# Altium schematic sheet DevCard.SchDoc: DevCard
size A3; Date: *******; ApprovedBy: *******; CheckedBy: None; Author: Annoyedmilk; CompanyName: *******; DrawnBy: Name; Engineer: *******; Organization: *******; Address1: *******; Address2: *******; Address3: *******; Address4: *******; DocumentNumber: Doc Num; Revision: *******; SheetNumber: 1; SheetTotal: 1; CurrentTime: *******; CurrentDate: *******; Time: *******; DocumentFullPathAndName: *******; DocumentName: *******; ModifiedDate: *******; ProjectName: *******; Application_BuildNumber: *******
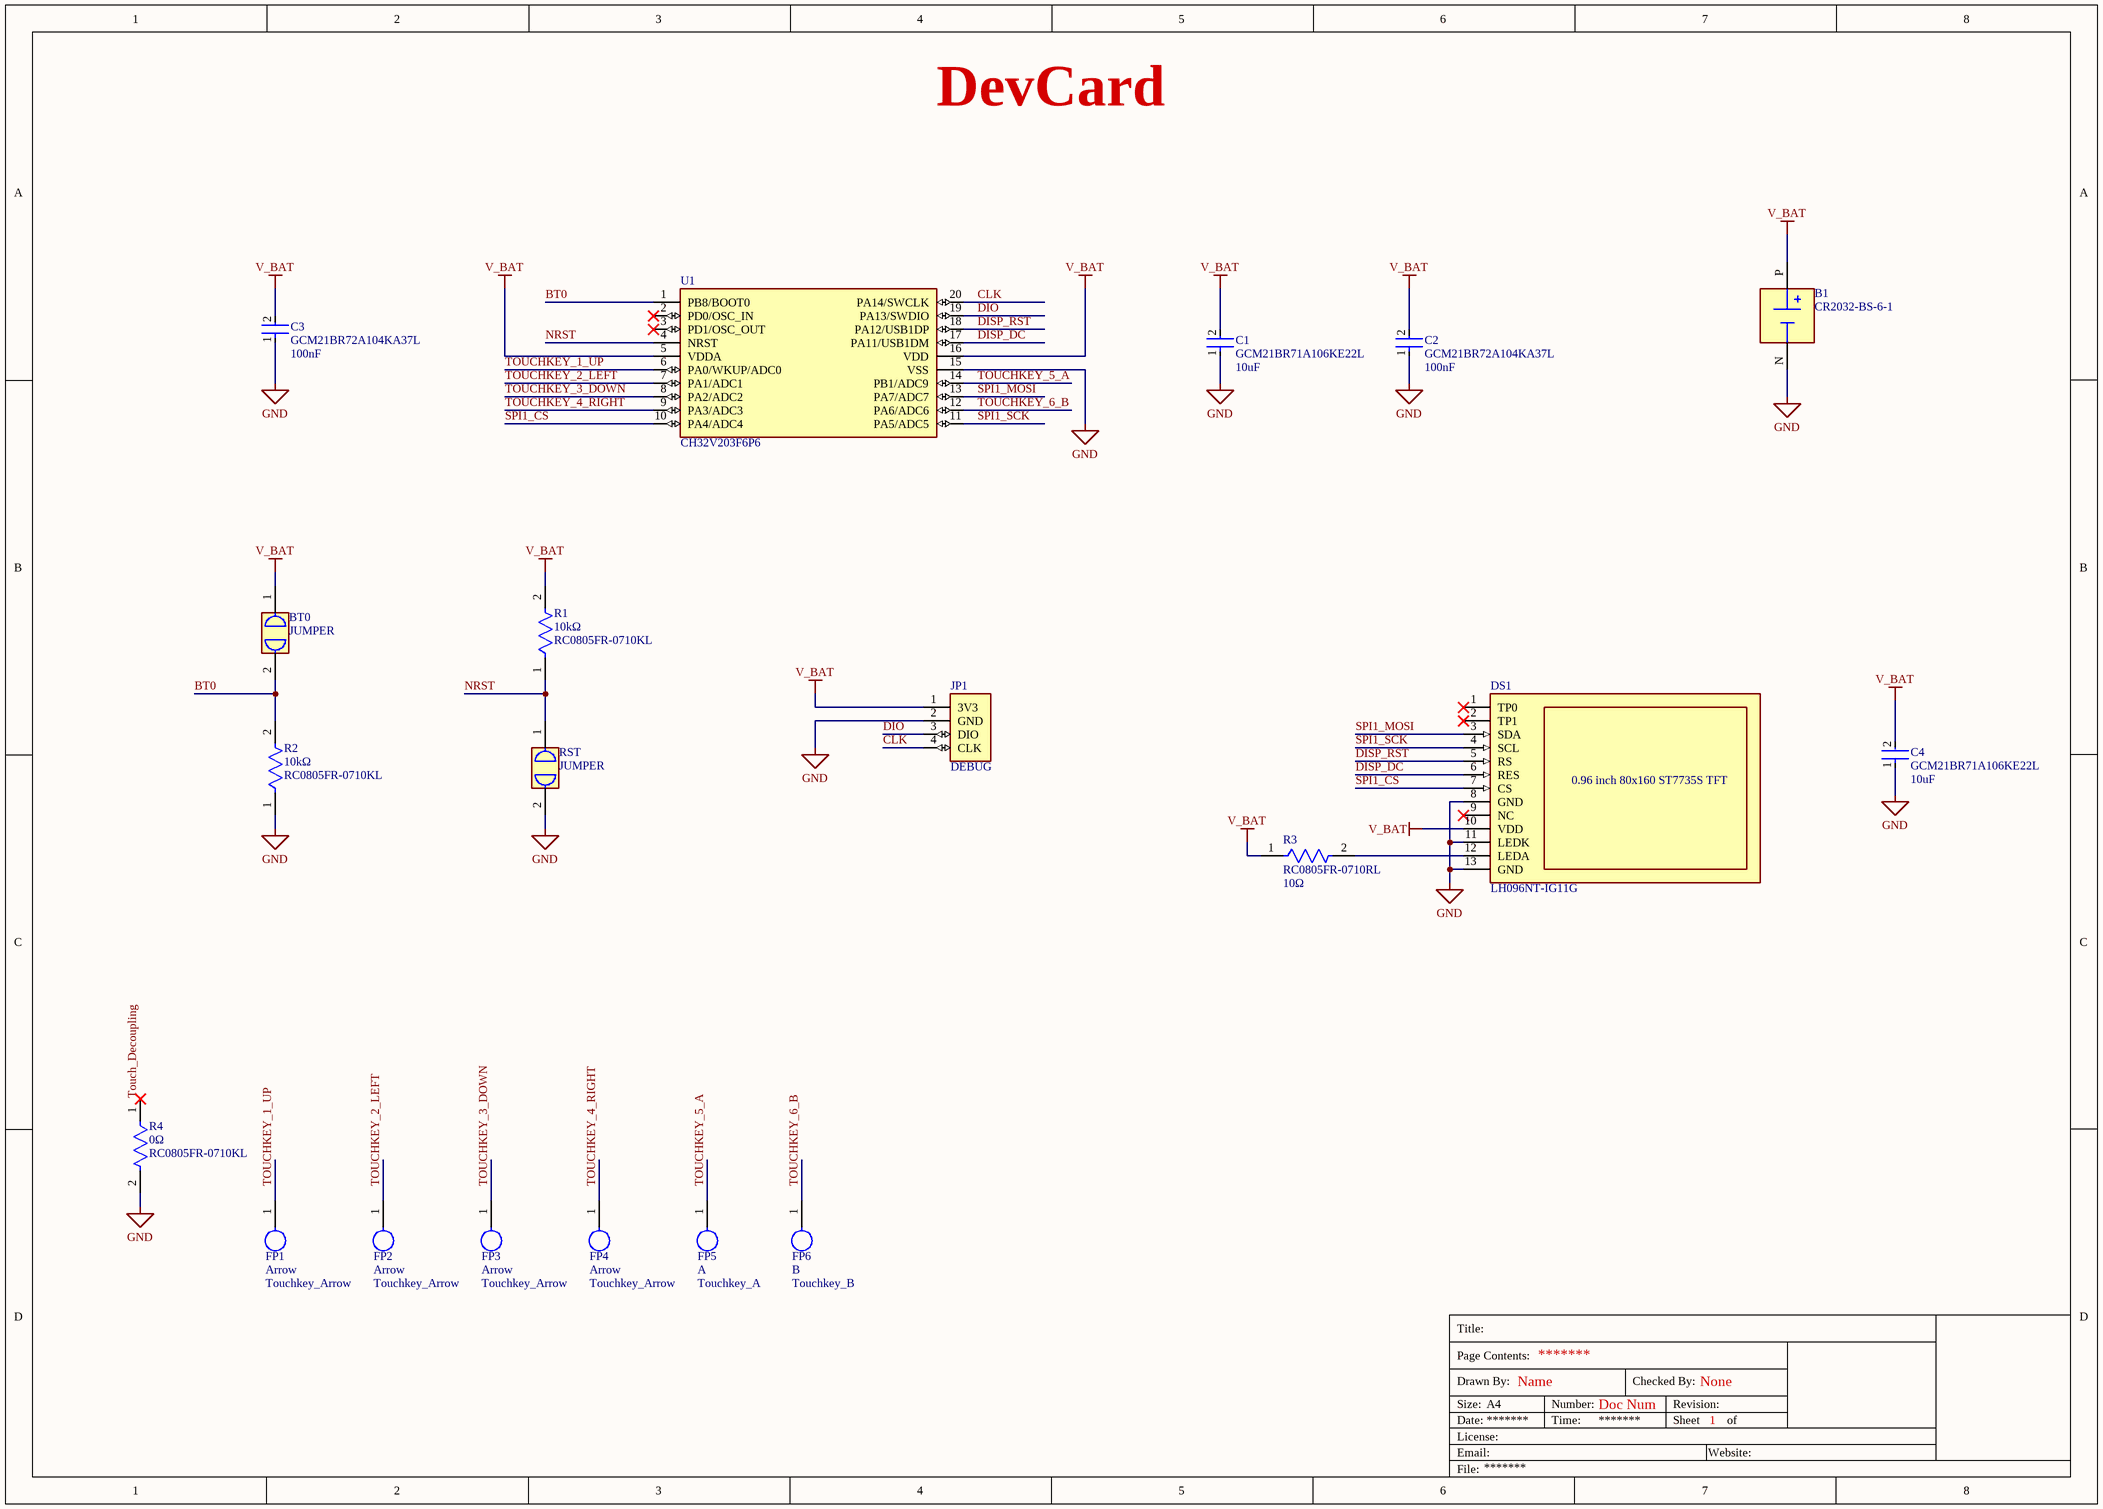
[diagram p0: DevCard.SchDoc]

## Parts
B1  Manufacturer Part Number: CR2032-BS-6-1  [BAT_CR2032-BS-6-1]  (hidden comment: Battery)
BT0  Manufacturer Part Number: JUMPER  [JUMPER_BOOT]  (hidden comment: Jumper_BOOT)
C1  Capacitance: 10uF  [C0805]  (hidden comment: GCM21BR71A106KE22L)
C2  Capacitance: 100nF  [C0805]  (hidden comment: GCM21BR72A104KA37L)
C3  Capacitance: 100nF  [C0805]  (hidden comment: GCM21BR72A104KA37L)
C4  Capacitance: 10uF  [C0805]  (hidden comment: GCM21BR71A106KE22L)
DS1  Manufacturer Part Number: LH096NT-IG11G  [0.96 - IPS LCD - No Glass - Flat]  (hidden comment: Display)
FP1  Arrow  [Touchkey_Arrow]
FP2  Arrow  [Touchkey_Arrow]
FP3  Arrow  [Touchkey_Arrow]
FP4  Arrow  [Touchkey_Arrow]
FP5  A  [Touchkey_A]
FP6  B  [Touchkey_B]
GL1  OPEN SOURCE HARDWARE  [OSH]  (value not drawn)
GL2  LICENSE  [License]  (value not drawn)
GL3  RV  [RV]  (value not drawn)
GL4  Annoyedmilk  [Annoyedmilk]  (value not drawn)
GL5  myCard  [myCard]  (value not drawn)
JP1  DEBUG  [DEBUG]
R1  Resistance: 10kΩ  [R0805]  (hidden comment: RC0805FR-0710KL)
R2  Resistance: 10kΩ  [R0805]  (hidden comment: RC0805FR-0710KL)
R3  Resistance: 10Ω  [R0805]  (hidden comment: RC0805FR-0710RL)
R4  Resistance: 0Ω  Manufacturer Part Number: RC0805FR-0710KL  [R0805]  (hidden comment: RC0805FR-100RL)
RST  Manufacturer Part Number: JUMPER  [JUMPER_RST]  (hidden comment: Jumper_RST)
U1  CH32V203F6P6  [SOP65P640X121-20N]

## Nets
GND: B1.N(NEG) C1.1 C2.1 C3.1 C4.1 DS1.8(GND) DS1.11(LEDK) DS1.13(GND) JP1.2(GND) R2.1 R4.2 RST.2 U1.15(VSS)
V_BAT: B1.P(POS) BT0.1 C1.2 C2.2 C3.2 C4.2 DS1.10(VDD) JP1.1(3V3) R1.2 R3.1 U1.5(VDDA) U1.16(VDD)
BT0: BT0.2 R2.2 U1.1(PB8/BOOT0)
CLK: JP1.4(CLK) U1.20(PA14/SWCLK)
DIO: JP1.3(DIO) U1.19(PA13/SWDIO)
DISP_DC: DS1.6(RES) U1.17(PA11/USB1DM)
DISP_RST: DS1.5(RS) U1.18(PA12/USB1DP)
NRST: R1.1 RST.1 U1.4(NRST)
SPI1_CS: DS1.7(CS) U1.10(PA4/ADC4)
SPI1_MOSI: DS1.3(SDA) U1.13(PA7/ADC7)
SPI1_SCK: DS1.4(SCL) U1.11(PA5/ADC5)
Touch_Decoupling: R4.1
TOUCHKEY_1_UP: FP1.1 U1.6(PA0/WKUP/ADC0)
TOUCHKEY_2_LEFT: FP2.1 U1.7(PA1/ADC1)
TOUCHKEY_3_DOWN: FP3.1 U1.8(PA2/ADC2)
TOUCHKEY_4_RIGHT: FP4.1 U1.9(PA3/ADC3)
TOUCHKEY_5_A: FP5.1 U1.14(PB1/ADC9)
TOUCHKEY_6_B: FP6.1 U1.12(PA6/ADC6)
NetDS1_12: DS1.12(LEDA) R3.2

Not connected (* = marked no-connect by the designer): DS1 1(TP0)* 2(TP1)* 9(NC)*; U1 2(PD0/OSC_IN)* 3(PD1/OSC_OUT)*

## Notes on the sheet
- Title:
- Drawn By:
- Page Contents:
- Checked By:
- Size:
- Date:
- File:
- License:
- Email:
- A4
- Number:
- Time:
- Revision:
- Sheet
- Website:
- of
- (in symbol Display) 0.96 inch 80x160 ST7735S TFT

## Library data of the parts
B1 = Battery: Battery holder CR2032 SMD; LCSC Part Number: C70377
BT0 = Jumper_BOOT: Solder Jumper
C1 C4 = GCM21BR71A106KE22L: 10uF X7R 0805 Multilayer Ceramic Capacitor; LCSC Part Number: C126586; Manufacturer Part Number: GCM21BR71A106KE22L
C2 C3 = GCM21BR72A104KA37L: 100nF X7R 0805 Multilayer Ceramic Capacitor; LCSC Part Number: C85866; Manufacturer Part Number: GCM21BR72A104KA37L
DS1 = Display: 0.96" IPS Display 80x160 Pixel ST7735 Driver SPI
FP1-FP4 = Arrow: Touchkey Arrow; Manufacturer Part Number: Touchkey_Arrow
FP5 = A: Touchkey A; Manufacturer Part Number: Touchkey_A
FP6 = B: Touchkey B; Manufacturer Part Number: Touchkey_B
GL1 = OPEN SOURCE HARDWARE: Open-source hardware image
GL2 = LICENSE: Creative Commons
GL3 = RV: RISC-V Image
GL4 = Annoyedmilk: Image
GL5 = myCard: Image
JP1 = DEBUG: DEBUG Header; Manufacturer Part Number: DEBUG
R1 R2 = RC0805FR-0710KL: 10kΩ 0805 Chip Resistor; LCSC Part Number: C84376; Manufacturer Part Number: RC0805FR-0710KL
R3 = RC0805FR-0710RL: 10Ω 0805 Chip Resistor; LCSC Part Number: C96347; Manufacturer Part Number: RC0805FR-0710RL
R4 = RC0805FR-100RL: 0Ω 0805 Chip Resistor; LCSC Part Number: C7336686
RST = Jumper_RST: Solder Jumper
U1 = CH32V203F6P6: QingKe 32-bit RISC-V4B microcontroller up to 144MHz with 10KB SRAM, 32KB Flash (TSSOP20 Package); LCSC Part Number: *; Manufacturer Part Number: CH32V203F6P6